# EAGLE board bmsbq (EAGLE 4.13), part 1 of 2
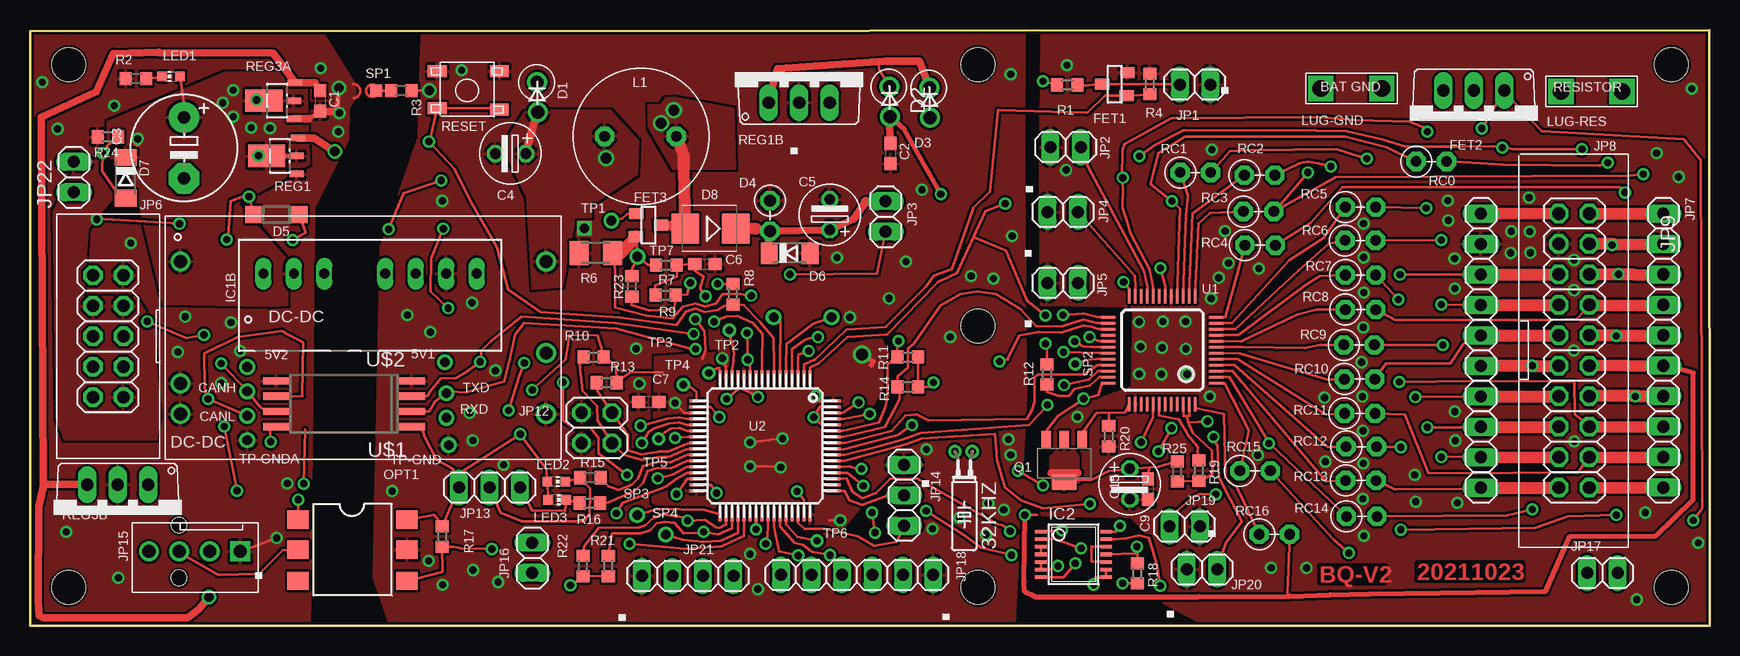
[diagram p2: board, top side]
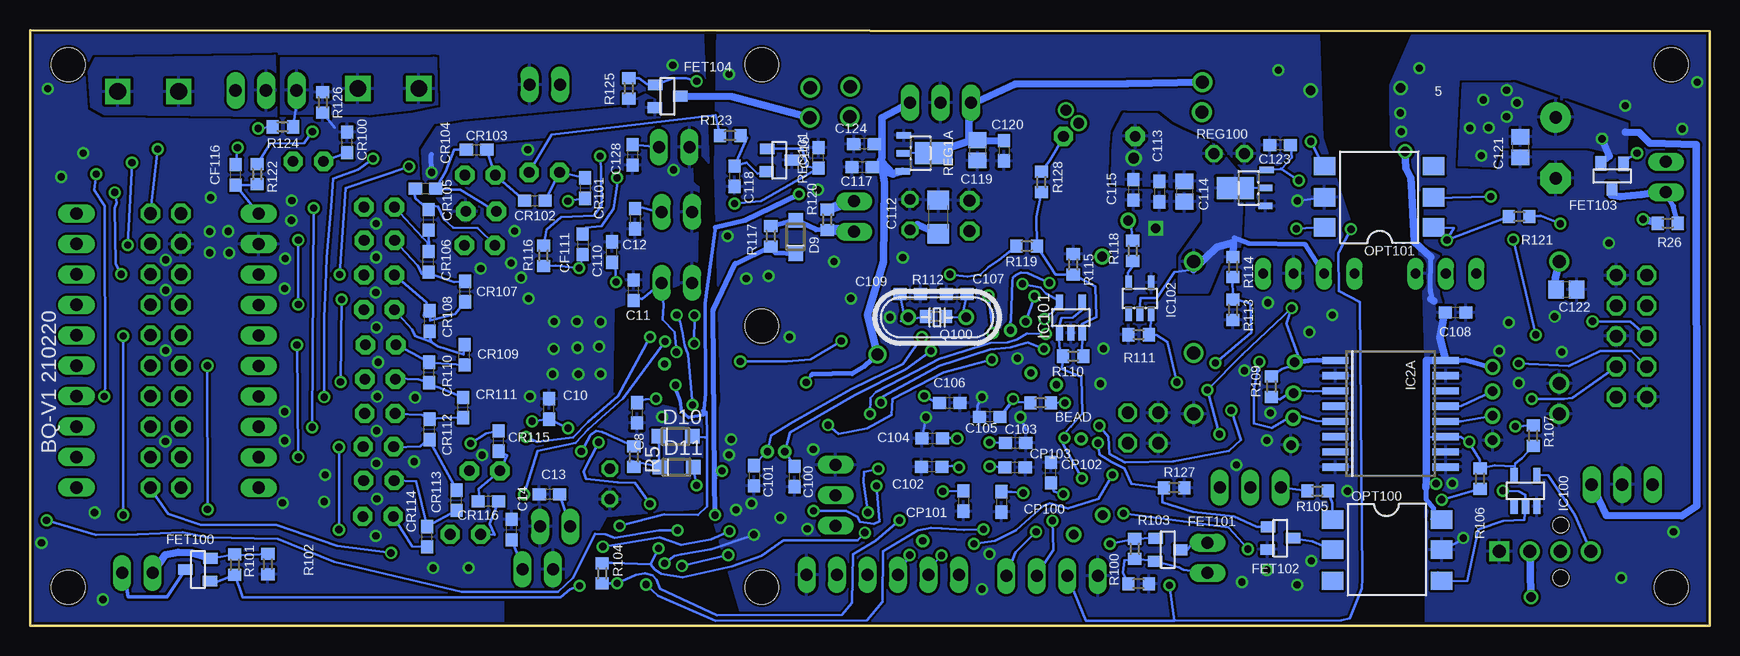
[diagram p3: board, bottom side, seen from below]

Size 140.02 x 49.7 mm. Coordinates in mm from the lower left corner, seen from the top.
Outline: 0.02,0.01 0,49.59 139.99,49.7 140.02,0 0.02,0.01
Copper layers (1*16): Top 0.035mm / dielectric 1.5mm / Bottom 0.035mm
Design rules "default": minimum track width 8mil, minimum drill 0.6mm, track to track 8mil, track to pad 8mil, pad to pad 8mil, via to via 8mil, smd to smd 0mil, copper to edge 8mil, drill to drill 8mil, minimum pad ring 10mil, minimum via ring 8mil, stop-mask expansion 4mil, vias tented up to drill 0mil, thermal gap 10mil
Holes 2.8 mm at 3.22,3.21 3.22,46.81 136.82,3.21 136.82,46.81 79.02,46.81 79.02,3.21 79.02,25.01

## Footprints (pad centres in the part's own frame; a part is rotated, then mirrored left to right if it is on the bottom)
SOLPAD028 = drill 0.8 pad 1.1 round: MP 0,0
32KHZ = drill 0.6 round: 1 -0.67,-3.1; 2 0.77,-3.1
R0603 = smd 1 x 1.1: 1 -0.85,0; 2 0.85,0
C0603 = smd 1.1 x 1: 1 -0.85,0; 2 0.85,0
E5-8,5 = drill 1.016 pad 2.54 round: + -2.54,0 | drill 1.016 pad 2.54 octagon: - 2.54,0
ES-2,5L = drill 0.889 pad 1.27 octagon: 1 0,0; 2 2.54,0
C1206 = smd 1.6 x 1.8: 1 -1.4,0; 2 1.4,0
C0805 = smd 1.3 x 1.5: 1 -0.85,0; 2 0.85,0
DO41-10_VERT = drill 1.1 round: A 2.58,0.05; C 0.07,0
ZENER-VERT = drill 1 pad 1.6 octagon: 1 0,0; 2 2.54,0
SOD123 = smd 1.4 x 1.4: A 1.9,0; C -1.9,0
SOD80C = smd 1.4 x 1.8: A 1.7,0; C -1.7,0
SMB_1 = smd 2.3 x 2.5: A 1.9,0; C -2.3,0
SOD123W = smd 1.2 x 1.2: A 1.4,0; C -1.4,0
SOT-23 = smd 0.9 x 1.2: 1 -1,-1.006; 2 0.9,-1.056; 3 -0.05,1.056
TO220V = drill 1.016 long: 1 -2.54,-2.54; 2 0,-2.54; 3 2.54,-2.54
DCDC7PINB = drill 0.813 long: 1 -7.62,2.51; 2 -5.08,2.51; 3 -2.54,2.51; 5 2.54,2.51; 6 5.08,2.51; 7 7.62,2.51; 8 10.16,2.51
TSSOP14 = smd 0.305 x 0.991: 1 -1.905,-2.718; 2 -1.27,-2.718; 3 -0.635,-2.718; 4 0,-2.718; 5 0.635,-2.718; 6 1.27,-2.718; 7 1.905,-2.718; 8 1.905,2.718; 9 1.27,2.718; 10 0.635,2.718; 11 0,2.718; 12 -0.635,2.718; 13 -1.27,2.718; 14 -1.905,2.718
SO-16DW = smd 0.6 x 2.2: 1 -4.445,-4.6; 2 -3.175,-4.6; 3 -1.905,-4.6; 4 -0.635,-4.6; 5 0.635,-4.6; 6 1.905,-4.6; 7 3.175,-4.6; 8 4.445,-4.6; 9 4.445,4.6; 10 3.175,4.6; 11 1.905,4.6; 12 0.635,4.6; 13 -0.635,4.6; 14 -1.905,4.6; 15 -3.175,4.6; 16 -4.445,4.6
SOT-23' = smd 0.6 x 1.2: 1 -0.95,-1.306; 2 0,-1.306; 3 0.95,-1.306; 4 0.95,1.306; 5 -0.95,1.306
SOT23-5 = smd 0.6 x 1.2: 1 -0.95,-1.306; 2 0,-1.306; 3 0.95,-1.306; 4 0.95,1.306; 5 -0.95,1.306
SOT23-5' = smd 0.55 x 1.2: 1 -0.95,-1.3; 2 0,-1.3; 3 0.95,-1.3; 4 0.95,1.3; 5 -0.95,1.3
1X02 = drill 1 long: 1 -1.27,0; 2 1.27,0
2X05_KEYED = drill 1.067 octagon: 1 -5.08,-1.27; 2 -5.08,1.27; 3 -2.54,-1.27; 4 -2.54,1.27; 5 0,-1.27; 6 0,1.27; 7 2.54,-1.27; 8 2.54,1.27; 9 5.08,-1.27; 10 5.08,1.27
1X10 = drill 1.016 long: 1 -11.43,0; 2 -8.89,0; 3 -6.35,0; 4 -3.81,0; 5 -1.27,0; 6 1.27,0; 7 3.81,0; 8 6.35,0; 9 8.89,0; 10 11.43,0
2X10_KEYED = drill 1.067 octagon: 1 -11.46,-1.27; 2 -11.46,1.27; 3 -8.92,-1.27; 4 -8.92,1.27; 5 -6.38,-1.27; 6 -6.38,1.27; 7 -3.84,-1.27; 8 -3.84,1.27; 9 -1.3,-1.27; 10 -1.3,1.27; 11 1.24,-1.27; 12 1.24,1.27; 13 3.78,-1.27; 14 3.78,1.27; 15 6.32,-1.27; 16 6.32,1.27; 17 8.86,-1.27; 18 8.86,1.27; 19 11.4,-1.27; 20 11.4,1.27
2X02 = drill 1.016 octagon: 1 -1.27,-1.27; 2 -1.27,1.27; 3 1.27,-1.27; 4 1.27,1.27
1X03 = drill 1 long: 1 -2.54,0; 2 0,0; 3 2.54,0
1X4-MOLEXKK = drill 1.1 square: 1 3.81,0 | drill 1.1 round: 2 1.27,0; 3 -1.27,0; 4 -3.81,0 | hole 1.3: -1.3,2.2; -1.3,-2.2
1X06 = drill 1 long: 1 -6.35,0; 2 -3.81,0; 3 -1.27,0; 4 1.27,0; 5 3.81,0; 6 6.35,0
1X04 = drill 1 long: 1 -3.81,0; 2 -1.27,0; 3 1.27,0; 4 3.81,0
INDUCTOR6.0 = drill 0.9 pad 1.6 octagon: 1 -3.04,0; 2 2.94,0
CHIP-LED0603 = smd 0.8 x 0.8: A 0,-0.75; C 0,0.75
SPADE_TAB = drill 1.4 square: G1 -2.54,0; G2 2.54,0
SMD-6 = smd 1.52 x 1.78: P$1 -2.5,-4.5; P$2 0,-4.5; P$3 2.6,-4.5; P$4 2.6,4.6; P$5 0,4.6; P$6 -2.5,4.6
SOT-89-BCE-X = smd 0.8 x 1.4: B -1.499,-1.981; C 0,-1.981; E 1.499,-1.981 | smd 2.032 x 1.27: C@1 0,1.575
HC49/S = drill 0.8 round: 1 -2.413,0; 2 2.413,0
M1206 = smd 1.6 x 2: 1 -1.4,0; 2 1.4,0
RS-2,5 = drill 0.889 pad 1.6 octagon: 1 0,0; 2 2.54,0
SOT89 = smd 0.55 x 1.2: 1 -1.5,-1.4; 2 0,-1.4; 3 1.5,-1.5 | smd 1.85 x 3.1: 4 0,1.1
TO220V' = drill 1.016 long: 1 -3.81,-1.27; 2 -1.27,-1.27; 3 1.27,-1.27
E-SWITCH2 = smd 1.55 x 1: 1 -2.7,1.6; 2 2.5,1.5; 3 2.5,-1.6; 4 -2.7,-1.6
SMD03 = smd 1 x 1: 1 0,0
SOLPAD.6MM = drill 0.6 pad 1.1 round: MP 0,0
TQFP48 = smd 0.208 x 1.2: 1 -2.75,-4.5; 2 -2.25,-4.5; 3 -1.75,-4.5; 4 -1.25,-4.5; 5 -0.75,-4.5; 6 -0.25,-4.5; 7 0.25,-4.5; 8 0.75,-4.5; 9 1.25,-4.5; 10 1.75,-4.5; 11 2.25,-4.5; 12 2.75,-4.5; 25 2.75,4.5; 26 2.25,4.5; 27 1.75,4.5; 28 1.25,4.5; 29 0.75,4.5; 30 0.25,4.5; 31 -0.25,4.5; 32 -0.75,4.5; 33 -1.25,4.5; 34 -1.75,4.5; 35 -2.25,4.5; 36 -2.75,4.5 | smd 1.2 x 0.208: 13 4.5,-2.75; 14 4.5,-2.25; 15 4.5,-1.75; 16 4.5,-1.25; 17 4.5,-0.75; 18 4.5,-0.25; 19 4.5,0.25; 20 4.5,0.75; 21 4.5,1.25; 22 4.5,1.75; 23 4.5,2.25; 24 4.5,2.75; 37 -4.5,2.75; 38 -4.5,2.25; 39 -4.5,1.75; 40 -4.5,1.25; 41 -4.5,0.75; 42 -4.5,0.25; 43 -4.5,-0.25; 44 -4.5,-0.75; 45 -4.5,-1.25; 46 -4.5,-1.75; 47 -4.5,-2.25; 48 -4.5,-2.75
TQFP64 = smd 1.2 x 0.26: 1 -5.7,3.75; 2 -5.7,3.25; 3 -5.7,2.75; 4 -5.7,2.25; 5 -5.7,1.75; 6 -5.7,1.25; 7 -5.7,0.75; 8 -5.7,0.25; 9 -5.7,-0.25; 10 -5.7,-0.75; 11 -5.7,-1.25; 12 -5.7,-1.75; 13 -5.7,-2.25; 14 -5.7,-2.75; 15 -5.7,-3.25; 16 -5.7,-3.75; 33 5.7,-3.75; 34 5.7,-3.25; 35 5.7,-2.75; 36 5.7,-2.25; 37 5.7,-1.75; 38 5.7,-1.25; 39 5.7,-0.75; 40 5.7,-0.25; 41 5.7,0.25; 42 5.7,0.75; 43 5.7,1.25; 44 5.7,1.75; 45 5.7,2.25; 46 5.7,2.75; 47 5.7,3.25; 48 5.7,3.75 | smd 0.26 x 1.2: 17 -3.75,-5.7; 18 -3.25,-5.7; 19 -2.75,-5.7; 20 -2.25,-5.7; 21 -1.75,-5.7; 22 -1.25,-5.7; 23 -0.75,-5.7; 24 -0.25,-5.7; 25 0.25,-5.7; 26 0.75,-5.7; 27 1.25,-5.7; 28 1.75,-5.7; 29 2.25,-5.7; 30 2.75,-5.7; 31 3.25,-5.7; 32 3.75,-5.7; 49 3.75,5.7; 50 3.25,5.7; 51 2.75,5.7; 52 2.25,5.7; 53 1.75,5.7; 54 1.25,5.7; 55 0.75,5.7; 56 0.25,5.7; 57 -0.25,5.7; 58 -0.75,5.7; 59 -1.25,5.7; 60 -1.75,5.7; 61 -2.25,5.7; 62 -2.75,5.7; 63 -3.25,5.7; 64 -3.75,5.7
SOIC-8 = smd 0.6 x 2.2: 1 -1.905,-5.6; 2 -0.635,-5.6; 3 0.635,-5.6; 4 1.905,-5.6; 5 1.905,5.7; 6 0.635,5.7; 7 -0.635,5.7; 8 -1.905,5.7
PYJ6-OD = drill 1.1 round: P$1 -7.62,12.7; P$2 -7.62,2.54; P$3 -7.62,0; P$4 22.86,0; P$5 22.86,5.08; P$6 22.86,12.7

## Placement (x,y rotation side)
5V1  SOLDPAD028  [SOLPAD028]  34.59,21.99 0 top
5V2  SOLDPAD028  [SOLPAD028]  18.1,21.6 0 top
32KHZ  X100  [32KHZ]  77.88,11.44 180 top
BEAD  1  [R0603]  55.78,18.6 180 bottom
C1  1u  [C0603]  24.18,43.78 270 top
C2  1u  [C0603]  71.73,39.4 270 top
C3  0.1u  [E5-8,5]  12.84,39.87 270 top
C4  10@25V  [ES-2,5L]  41.33,39.39 180 top
C5  1u@100v  [ES-2,5L]  66.66,33.03 90 top
C6  0.1u  [C0603]  56.26,30.18 0 top
C7  100n  [C0603]  51.57,18.66 180 top
C8  22n  [C0603]  89.42,17.77 270 bottom
C9  1u  [C0603]  93.19,11.41 270 top
C10  1u  [C0603]  96.75,18.1 90 bottom
C11  10n  [C0603]  89.7,27.99 90 bottom
C12  10n  [C0603]  89.58,33.96 270 bottom
C13  10n  [C0603]  96.72,10.98 180 bottom
C14  10n  [C0603]  99.87,8.03 90 bottom
C15  1u@100v  [ES-2,5L]  91.68,13.11 270 top
C100  10p  [C0603]  76.31,12.46 270 bottom
C101  10p  [C0603]  79.65,12.52 270 bottom
C102  100n  [C0603]  64.85,13.28 180 bottom
C103  100n  [C0603]  57.87,15.28 0 bottom
C104  1u  [C0603]  64.82,15.63 180 bottom
C105  100n  [C0603]  60.02,17.44 180 bottom
C106  100n  [C0603]  63.36,18.61 0 bottom
C107  15p  [C0603]  62.77,27.66 180 bottom
C108  4.7u  [C0603]  21.19,26.15 0 bottom
C109  15p  [C0603]  66.65,27.68 0 bottom
C110  2.2u  [C0603]  91.52,31.18 90 bottom
C112  1u@100v  [C1206]  64.3,34.1 90 bottom
C113  10n  [C0603]  45.87,36.22 270 bottom
C114  4.7u  [C0805]  43.79,36.24 270 bottom
C115  0.1u  [C0603]  48.04,36.36 270 bottom
C116  2.2u  [C0603]  74.3,39.04 90 bottom
C117  100n  [C0603]  70.66,38.25 180 bottom
C118  2.2u  [C0603]  81.3,37.5 270 bottom
C119  4.7u  [C0805]  61.03,39.66 270 bottom
C120  100n  [C0603]  58.85,39.63 270 bottom
C121  4.7u  [C0805]  15.79,39.94 270 bottom
C122  4.7u  [C0805]  11.95,28.07 0 bottom
C123  4.7u  [C0603]  35.82,40.1 180 bottom
C124  4.7u  [C0603]  70.5,40.2 180 bottom
C128  10n  [C0603]  89.79,39.29 270 bottom
CANH  SOLDPAD028  [SOLPAD028]  18.1,19.56 0 top
CANL  SOLDPAD028  [SOLPAD028]  18.1,17.52 0 top
CF111  0.1u  [C0603]  93.94,31.82 270 bottom
CF116  0.1u  [C0603]  122.86,37.62 90 bottom
CP100  2.2u  [C0603]  59.04,10.35 270 bottom
CP101  2.2u  [C0603]  62.22,10.42 270 bottom
CP102  4.7u  [C0603]  54.93,12.78 90 bottom
CP103  4.7u  [C0603]  57.91,13.23 0 bottom
CR100  0.1u  [C0603]  113.57,40.32 90 bottom
CR101  0.1u  [C0603]  93.76,36.51 270 bottom
CR102  0.1u  [C0603]  97.94,35.47 0 bottom
CR103  0.1u  [C0603]  102.79,39.72 0 bottom
CR104  0.1u  [C0603]  107.05,36.49 0 bottom
CR105  0.1u  [C0603]  106.79,33.87 90 bottom
CR106  0.1u  [C0603]  106.8,30.37 90 bottom
CR107  0.1u  [C0603]  103.74,27.89 90 bottom
CR108  0.1u  [C0603]  106.69,25.43 90 bottom
CR109  0.1u  [C0603]  103.81,22.6 90 bottom
CR110  0.1u  [C0603]  106.74,21.14 90 bottom
CR111  0.1u  [C0603]  103.92,18.21 90 bottom
CR112  0.1u  [C0603]  106.72,16.39 90 bottom
CR113  0.1u  [C0603]  104.47,10.48 90 bottom
CR114  0.1u  [C0603]  106.91,7.44 90 bottom
CR115  0.1u  [C0603]  100.94,15.42 90 bottom
CR116  0.1u  [C0603]  101.82,10.4 180 bottom
D1  1N4148  [DO41-10_VERT]  42.28,45.42 270 top
D2  1N4148  [DO41-10_VERT]  71.64,45.05 270 top
D3  1N4148  [DO41-10_VERT]  74.97,44.96 270 top
D4  1N5357  [ZENER-VERT]  61.69,35.48 270 top
D5  1N4448  [SOD123]  20.54,34.31 180 top
D6  MMSZ52  [SOD80C]  63.33,31.08 0 top
D7  MMSZ52  [SOD80C]  7.98,37.38 270 top
D8  B100LB  [SMB_1]  56.53,33.13 180 top
D9  PMEG10020  [SOD123W]  76.2,32.44 90 bottom
D10  PMEG10020  [SOD123W]  86.22,15.81 0 bottom
D11  PMEG10020  [SOD123W]  86.13,13.25 0 bottom
FET1  NFET  [SOT-23]  90.42,45.23 90 top
FET2  100v NFET  [TO220V]  120.35,42.12 180 top
FET3  PMV280ENEA  [SOT-23]  51.55,33.38 270 top
FET100  si2324A  [SOT-23]  126.02,4.75 90 bottom
FET101  NFET  [SOT-23]  45.18,6.3 270 bottom
FET102  NFET  [SOT-23]  35.8,7.27 270 bottom
FET103  PMV35EPE  [SOT-23]  8.19,37.53 180 bottom
FET104  PFET  [SOT-23]  86.88,44.12 270 bottom
IC1B  AM6G1215SNZ  [DCDC7PINB]  27.07,26.87 0 top
IC2  7402  [TSSOP14]  86.99,5.97 270 top
IC2A  ISO1042-16PIN  [SO-16DW]  26.61,17.69 270 bottom
IC100  74LVC1G14  [SOT-23']  15.36,11.27 0 bottom
IC101  TLV521  [SOT23-5]  53.26,25.72 0 bottom
IC102  MCP1401|1416  [SOT23-5']  47.5,27.32 0 bottom
JP1  PB  [1X02]  97.11,45.15 180 top
JP2  THERM1  [1X02]  86.32,39.93 0 top
JP3  [1X02]  71.32,34.15 90 top
JP4  THERM2  [1X02]  86.1,34.53 0 top
JP5  THERM3  [1X02]  86.1,28.6 0 top
JP6  PINHD-2X5_KEYED  [2X05_KEYED]  6.52,24.16 90 top
JP7  OUTSIDE  [1X10]  136.15,22.97 270 top
JP8  INSIDE  [1X10]  120.95,22.96 270 top
JP9  PINHD-2X10_KEYED  [2X10_KEYED]  128.71,22.94 270 top
JP12  [2X02]  47.24,16.51 270 top
JP13  [1X03]  38.3,11.55 0 top
JP14  SWD  [1X03]  72.87,10.89 270 top
JP15  PINHD-1X4-MOLEXKK  [1X4-MOLEXKK]  13.72,6.21 0 top
JP16  Dump2  [1X02]  41.87,5.68 90 top
JP17  DUMP  [1X02]  131.07,4.41 0 top
JP18  FTDI  [1X06]  68.94,4.26 180 top
JP19  THERM4  [1X02]  96.25,8.3 180 top
JP20  THERM5  [1X02]  97.69,4.72 0 top
JP21  [1X04]  54.83,4.17 0 top
JP22  I-sense  [1X02]  3.65,37.43 90 top
L1  RFB1010  [INDUCTOR6.0]  50.93,40.83 0 top
LED1  [CHIP-LED0603]  11.76,45.83 90 top
LED2  [CHIP-LED0603]  43.86,12.03 270 top
LED3  [CHIP-LED0603]  43.94,10.51 270 top
LUG-GND  MINUS  [SPADE_TAB]  110.15,44.82 0 top
LUG-RES  RESIS  [SPADE_TAB]  130.17,44.57 0 top
OPT1  H11L1S  [SMD-6]  26.83,6.36 270 top
OPT100  H11L1S  [SMD-6]  26.95,6.36 270 bottom
OPT101  H11L1S  [SMD-6]  27.51,35.75 90 bottom
Q1  BCX65T-16OK  [SOT-89-BCE-X]  86.21,13.57 180 top
Q100  [HC49/S]  64.4,25.73 180 bottom
R1  100K  [R0603]  86.47,45.11 0 top
R2  6.8K  [R0603]  8.84,45.64 0 top
R3  10M  [R0603]  30.95,44.64 0 top
R4  2M  [R0603]  93.35,45.19 270 top
R5  10K  [R0603]  89.68,14.12 270 bottom
R6  0.1  [M1206]  47.16,31.11 0 top
R7  1.5K  [R0603]  53.03,30.09 0 top
R8  10K  [R0603]  58.6,27.67 90 top
R9  zero?  [R0603]  52.98,27.59 0 top
R10  10K  [R0603]  46.98,22.42 0 top
R11  3.3K  [R0603]  73.17,22.42 180 top
R12  zero  [R0603]  84.77,20.97 270 top
R13  10K  [R0603]  48.06,20.29 0 top
R14  3.3K  [R0603]  73.17,19.93 180 top
R15  6.8K  [R0603]  46.7,12.36 0 top
R16  3.3K  [R0603]  46.66,10.24 0 top
R17  10K  [R0603]  34.36,7.45 90 top
R18  470K  [R0603]  92.31,4.39 270 top
R19  10K  [R0603]  97.43,12.96 270 top
R20  10M  [R0603]  89.92,15.81 270 top
R21  3.3K  [R0603]  48.2,5 270 top
R22  3.3K  [R0603]  46.1,5 270 top
R23  zero?  [R0603]  50.17,28.32 270 top
R24  1M  [R0603]  6.49,40.78 180 top
R25  1K  [R0603]  95.64,12.89 90 top
R26  0.1  [R0603]  3.5,33.58 0 bottom
R100  1K  [R0603]  47.61,3.52 0 bottom
R101  470K  [R0603]  122.95,5.11 270 bottom
R102  33k  [R0603]  120.19,5.16 90 bottom
R103  2M  [R0603]  47.93,6.43 270 bottom
R104  470K  [R0603]  92.33,4.39 270 bottom
R105  1.8K  [R0603]  32.7,11.26 180 bottom
R106  1.8K  [R0603]  19.15,12.28 270 bottom
R107  10K  [R0603]  14.72,15.87 270 bottom
R109  100K  [R0603]  36.54,19.96 90 bottom
R110  zero?  [R0603]  53.06,22.5 180 bottom
R111  470K  [R0603]  47.6,24.29 0 bottom
R112  1M  [R0603]  64.5,25.81 0 bottom
R113  6.8K  [R0603]  39.74,26.35 270 bottom
R114  33K  [R0603]  39.74,29.93 270 bottom
R115  210K  [R0603]  53.06,30.15 270 bottom
R116  100  [R0603]  97.21,30.88 270 bottom
R117  zero?  [R0603]  78.27,32.5 90 bottom
R118  6.8  [R0603]  48.1,31.28 270 bottom
R119  4M  [R0603]  56.93,31.68 180 bottom
R120  1  [R0603]  73.56,33.88 270 bottom
R121  3.3K  [R0603]  15.88,34.15 180 bottom
R122  100  [R0603]  121.08,37.68 90 bottom
R123  100K  [R0603]  81.66,40.89 180 bottom
R124  470K  [R0603]  118.95,41.62 180 bottom
R125  1M  [R0603]  90.11,44.84 270 bottom
R126  33k  [R0603]  115.62,43.67 270 bottom
R127  1M  [R0603]  44.64,11.52 0 bottom
R128  64K  [R0603]  55.72,37.02 90 bottom
RC0  [RS-2,5]  115.55,38.74 0 top
RC1  [RS-2,5]  95.88,37.82 0 top
RC2  [RS-2,5]  101.23,37.6 0 top
RC3  [RS-2,5]  101.15,34.57 0 top
RC4  [RS-2,5]  101.27,31.75 0 top
RC5  [RS-2,5]  109.64,34.93 0 top
RC6  [RS-2,5]  109.62,32.15 0 top
RC7  [RS-2,5]  109.64,29.26 0 top
RC8  [RS-2,5]  109.65,26.38 0 top
RC9  [RS-2,5]  109.52,23.44 0 top
RC10  [RS-2,5]  109.56,20.58 0 top
RC11  [RS-2,5]  109.58,17.72 0 top
RC12  [RS-2,5]  109.71,14.95 0 top
RC13  [RS-2,5]  109.67,12.13 0 top
RC14  [RS-2,5]  109.74,9.13 0 top
RC15  [RS-2,5]  100.85,12.94 0 top
RC16  [RS-2,5]  102.46,7.64 0 top
REG1  AP7380Y  [SOT89]  20.83,39.2 90 top
REG1A  AP7380Y  [SOT89]  65.78,39.42 270 bottom
REG1B  VXO7803-500  [TO220V']  65.39,44.91 0 top
REG3A  LDK320ADU120R  [SOT89]  20.6,43.8 90 top
REG3B  LM7812T  [TO220V']  6.04,10.52 180 top
REG100  AP7380Y  [SOT89]  38.44,36.52 90 bottom
REG101  MCP1810  [SOT-23]  77.57,38.79 270 bottom
RESET  E-SWITCH2  [E-SWITCH2]  36.44,44.66 180 top
RXD  SOLDPAD028  [SOLPAD028]  34.72,17.35 0 top
SP1  SMD03  [SMD03]  28.87,44.65 0 top
SP2  SOLDPAD0.6MM  [SOLPAD.6MM]  87.12,21.85 0 top
SP3  SOLDPAD028  [SOLPAD028]  50.61,9.23 0 top
SP4  SOLDPAD028  [SOLPAD028]  53.01,7.61 0 top
TP1  SOLDPAD028  [SOLPAD028]  48.47,33.8 0 top
TP2  SOLDPAD0.6MM  [SOLPAD.6MM]  58.29,24.65 0 top
TP3  SOLDPAD0.6MM  [SOLPAD.6MM]  56.58,21.09 0 top
TP4  SOLDPAD0.6MM  [SOLPAD.6MM]  54.45,20.11 0 top
TP5  SOLDPAD0.6MM  [SOLPAD.6MM]  52.4,15.6 0 top
TP6  SOLDPAD0.6MM  [SOLPAD.6MM]  65.61,7.1 0 top
TP7  SOLDPAD028  [SOLPAD028]  50.64,30.8 0 top
TP-GND  SOLDPAD028  [SOLPAD028]  34.9,15.09 0 top
TP-GNDA  SOLDPAD028  [SOLPAD028]  18.1,15.48 0 top
TXD  SOLDPAD028  [SOLPAD028]  34.7,19.41 0 top
U1  BQ76952  [TQFP48]  94.38,23 90 top
U2  STM32F10XRXT6  [TQFP64]  61.27,15.02 270 top
U$1  ISO1042  [SOIC-8]  26.23,18.52 90 top
U$2  PY6J6-OD  [PYJ6-OD]  20.16,17.69 0 top